# Altium schematic sheet FIT_HDMI_X21-17.SchDoc: FIT_PM12 board
size 420 x 297 mm; CheckedBy: G.Kasprowicz; Author: INR Moscow; CompanyName: WUT ISE; DrawnBy: M.Podgórski; Organization: WUT ISE; Address1: PW ISE; Address2: Nowowiejska 15/19 00-665 Warsaw; Address3: gkasprow@gmail.com; Revision: 2; SheetNumber: -; SheetTotal: -; ModifiedBy: -; CheckedDate: -; Title2: Title 2; DivGrp: WUT ISE; Designer: INR RAS; ModifiedDate: -; ProjectName: Sensor Box
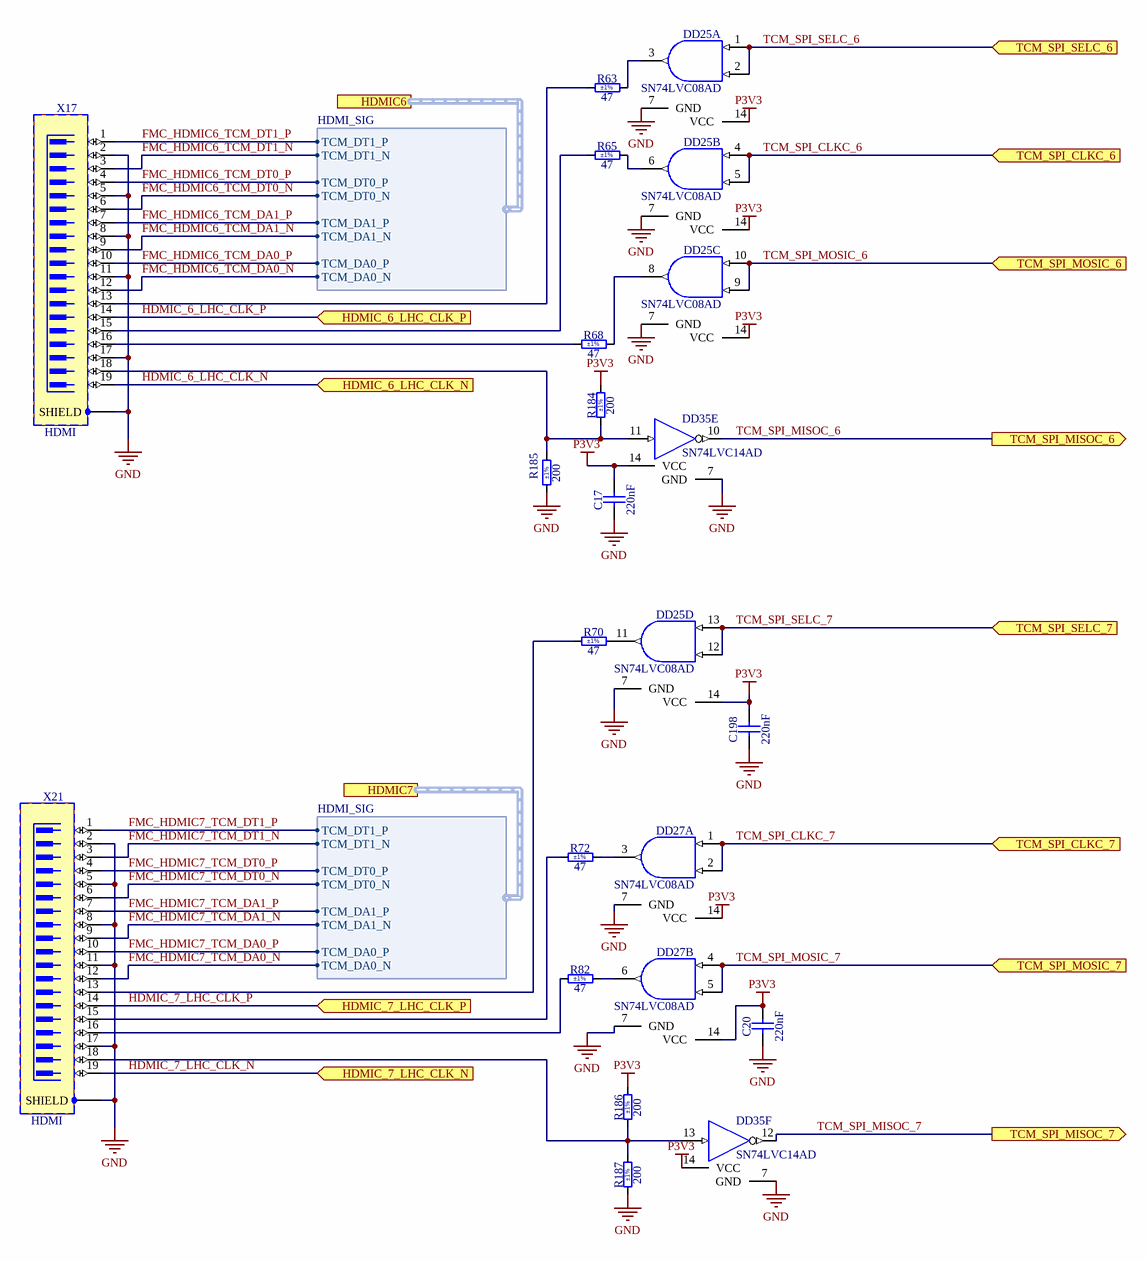
[diagram p0: FIT_HDMI_X21-17.SchDoc]

## Parts
C17  220nF  [CAPC2012X135N]
C20  220nF  [CAPC2012X135N]
C198  220nF  [CAPC2012X135N]
DD25  SN74LVC08AD  [SOIC127P600X175-14N]  (parts A,B,C,D of 4)
DD27  SN74LVC08AD  [SOIC127P600X175-14N]  (parts A,B of 4)
DD35  SN74LVC14AD  [SOIC127P600X175-14N]  (parts E,F of 6)
R63  47  Tolerance: ±1%  [RESC2012X60N]
R65  47  Tolerance: ±1%  [RESC2012X60N]
R68  47  Tolerance: ±1%  [RESC2012X60N]
R70  47  Tolerance: ±1%  [RESC2012X60N]
R72  47  Tolerance: ±1%  [RESC2012X60N]
R82  47  Tolerance: ±1%  [RESC2012X60N]
R184  200  Tolerance: ±1%  [RESC2012X60N]
R185  200  Tolerance: ±1%  [RESC2012X60N]
R186  200  Tolerance: ±1%  [RESC2012X60N]
R187  200  Tolerance: ±1%  [RESC2012X60N]
X17  HDMI  [TYCO_2007435-1]
X21  HDMI  [TYCO_2007435-1]

## Ports
HDMIC6 (harness HDMI_SIG), HDMIC7 (harness HDMI_SIG), HDMIC_6_LHC_CLK_N (in), HDMIC_6_LHC_CLK_P (in), HDMIC_7_LHC_CLK_N (in), HDMIC_7_LHC_CLK_P (in), TCM_SPI_CLKC_6 (in), TCM_SPI_CLKC_7 (in), TCM_SPI_MISOC_6 (out), TCM_SPI_MISOC_7 (out), TCM_SPI_MOSIC_6 (in), TCM_SPI_MOSIC_7 (in), TCM_SPI_SELC_6 (in), TCM_SPI_SELC_7 (in)

## Harnesses
HDMI_SIG: TCM_DT1_P, TCM_DT1_N, TCM_DT0_P, TCM_DT0_N, TCM_DA1_P, TCM_DA1_N, TCM_DA0_P, TCM_DA0_N

## Nets
GND: C17.1 C20.1 C198.1 DD25.7(GND) DD27.7(GND) DD35.7(GND) R185.1 R187.1 X17.2 X17.5 X17.8 X17.11 X17.17 X17.SHIELD X21.2 X21.5 X21.8 X21.11 X21.17 X21.SHIELD
P3V3: C17.2 C20.2 C198.2 DD25.14(VCC) DD27.14(VCC) DD35.14(VCC) R184.2 R186.2  [also labelled VCC]
FMC_HDMIC6_TCM_DA0_N: X17.12 ; port HDMIC6.TCM_DA0_N
FMC_HDMIC6_TCM_DA0_P: X17.10 ; port HDMIC6.TCM_DA0_P
FMC_HDMIC6_TCM_DA1_N: X17.9 ; port HDMIC6.TCM_DA1_N
FMC_HDMIC6_TCM_DA1_P: X17.7 ; port HDMIC6.TCM_DA1_P
FMC_HDMIC6_TCM_DT0_N: X17.6 ; port HDMIC6.TCM_DT0_N
FMC_HDMIC6_TCM_DT0_P: X17.4 ; port HDMIC6.TCM_DT0_P
FMC_HDMIC6_TCM_DT1_N: X17.3 ; port HDMIC6.TCM_DT1_N
FMC_HDMIC6_TCM_DT1_P: X17.1 ; port HDMIC6.TCM_DT1_P
FMC_HDMIC7_TCM_DA0_N: X21.12 ; port HDMIC7.TCM_DA0_N
FMC_HDMIC7_TCM_DA0_P: X21.10 ; port HDMIC7.TCM_DA0_P
FMC_HDMIC7_TCM_DA1_N: X21.9 ; port HDMIC7.TCM_DA1_N
FMC_HDMIC7_TCM_DA1_P: X21.7 ; port HDMIC7.TCM_DA1_P
FMC_HDMIC7_TCM_DT0_N: X21.6 ; port HDMIC7.TCM_DT0_N
FMC_HDMIC7_TCM_DT0_P: X21.4 ; port HDMIC7.TCM_DT0_P
FMC_HDMIC7_TCM_DT1_N: X21.3 ; port HDMIC7.TCM_DT1_N
FMC_HDMIC7_TCM_DT1_P: X21.1 ; port HDMIC7.TCM_DT1_P
HDMIC_6_LHC_CLK_N: X17.19 ; port HDMIC_6_LHC_CLK_N
HDMIC_6_LHC_CLK_P: X17.14 ; port HDMIC_6_LHC_CLK_P
HDMIC_7_LHC_CLK_N: X21.19 ; port HDMIC_7_LHC_CLK_N
HDMIC_7_LHC_CLK_P: X21.14 ; port HDMIC_7_LHC_CLK_P
TCM_SPI_CLKC_6: DD25.4(A) DD25.5(B) ; port TCM_SPI_CLKC_6
TCM_SPI_CLKC_7: DD27.1(A) DD27.2(B) ; port TCM_SPI_CLKC_7
TCM_SPI_MISOC_6: DD35.10(OUT) ; port TCM_SPI_MISOC_6
TCM_SPI_MISOC_7: DD35.12(OUT) ; port TCM_SPI_MISOC_7
TCM_SPI_MOSIC_6: DD25.9(B) DD25.10(A) ; port TCM_SPI_MOSIC_6
TCM_SPI_MOSIC_7: DD27.4(A) DD27.5(B) ; port TCM_SPI_MOSIC_7
TCM_SPI_SELC_6: DD25.1(A) DD25.2(B) ; port TCM_SPI_SELC_6
TCM_SPI_SELC_7: DD25.12(B) DD25.13(A) ; port TCM_SPI_SELC_7
NetDD25_3: DD25.3(Y) R63.2
NetDD25_6: DD25.6(Y) R65.2
NetDD25_8: DD25.8(Y) R68.2
NetDD25_11: DD25.11(Y) R70.2
NetDD27_3: DD27.3(Y) R72.2
NetDD27_6: DD27.6(Y) R82.2
NetDD35_11: DD35.11(IN) R184.1 R185.2 X17.18
NetDD35_13: DD35.13(IN) R186.1 R187.2 X21.18
NetR63_1: R63.1 X17.13
NetR65_1: R65.1 X17.15
NetR68_1: R68.1 X17.16
NetR70_1: R70.1 X21.13
NetR72_1: R72.1 X21.15
NetR82_1: R82.1 X21.16

## Notes on the sheet
- Project/Equipment
- Document
- Designer
- Drawn by
- Check.by
- Copyright WUT ISE 2024.
  This documentation describes Open Hardware and is licensed under the CERN OHL v.2. You may redistribute and modify this documentation under the terms of the CERN OHL v.2. (http://ohwr.org/CERNOHL). This documentation is distributed WITHOUT ANY EXPRESS OR IMPLIED WARRANTY, INCLUDING OF MERCHANTABILITY, SATISFACTORY QUALITY AND FITNESS FOR A PARTICULAR PURPOSE. Please see the CERN OHL v.2 for applicable conditions.
- Contact
- File
- Last Mod.
- Print Date
- Sheet
- Size
- A3
- of
- Rev

## Library data of the parts
C17 C20 C198 = CC0805_220NF_50V_10%_X7R: Non-polarised capacitor; Part Description: SMD Multilayer Chip Ceramic Capacitor; Manufacturer: GENERIC; Manufacturer1 Part Number: GRM21BR71H224KA01L; Voltage: 50V; TC: X7R; Tolerance: ±10%; Part Number: CC0805_220NF_50V_10%_X7R; Component Kind: Standard; Component Type: Standard; Pin Count: 2; Value: 220nF; Status: Preferred; Manufacturer Part Number: CC0805_220NF_50V_10%_X7R; Case: 0805; Mounted: Yes; Socket: No; SMD: Yes; Sense: No; Manufacturer1 Example: MURATA; Manufacturer1 ComponentHeight: 1.35mm; HelpURL: \\cern.ch\dfs\Applications\Altium\Datasheets\CC0805_X7R_MURATA.pdf; Author: CERN DEM JLC; CreateDate: 03.12.2007; LatestRevisionDate: 03.12.2007
DD25 DD27 = SN74LVC08AD: Quad 2-Input AND Gate; Part Description: Quadruple 2-Input Positive-AND Gate; Manufacturer: TEXAS INSTRUMENTS; PressFit: No; Bonding: No; Part Number: SN74LVC08AD; Component Kind: Standard; Component Type: Standard; Device: SN74LVC08AD; PackageDescription: SOIC 14, Pitch 1.27mm - Body 4x8.75mm, IPC Medium Density; Manufacturer Part Number: SN74LVC08AD; Pin Count: 14; Case: SOIC14; Mounted: Yes; Socket: No; SMD: Yes; Sense: No; ComponentHeight: 1.75mm; Author: CERN DEM JLC; HelpURL: \\cern.ch\dfs\Applications\Altium\Datasheets\SN74LVC08AD.pdf; CreateDate: 21.03.2012; LatestRevisionDate: 21.03.2012
DD35 = SN74LVC14AD: Hex Schmitt-Trigger Inverter; Manufacturer: TEXAS INSTRUMENTS; PressFit: No; Bonding: No; Part Number: SN74LVC14AD; Component Kind: Standard; Component Type: Standard; Device: SN74LVC14AD; PackageDescription: SOIC 14, Pitch 1.27mm - Body 4x8.75mm, IPC Medium Density; Part Description: Hex Schmitt-Trigger Inverter; Manufacturer Part Number: SN74LVC14AD; Pin Count: 14; Case: SOIC14; Mounted: Yes; Socket: No; SMD: Yes; Sense: No; ComponentHeight: 1.75mm; Author: CERN DEM JMW; HelpURL: \\cern.ch\dfs\Applications\Altium\Datasheets\SN74LVC14AD.pdf; CreateDate: 29.09.2008; LatestRevisionDate: 29.09.2008
R63 R65 R68 R70 R72 R82 = R0805_47R_1%_0.125W_100PPM: Resistor - 1%; Part Description: General Purpose Thick Film Chip Resistor; Manufacturer: GENERIC; Manufacturer1 Part Number: NRC10F47R0TRF; Power: 0.125W; TC: ±100ppm/°C; PressFit: No; Part Number: R0805_47R_1%_0.125W_100PPM; Component Kind: Standard; Component Type: Standard; Pin Count: 2; Value: 47; Status: Preferred; Manufacturer Part Number: R0805_47R_1%_0.125W_100PPM; Case: 0805; Mounted: Yes; Sense: No; Socket: No; SMD: Yes; Manufacturer1 Example: NIC COMPONENT; Manufacturer1 ComponentHeight: 0.6mm; HelpURL: \\cern.ch\dfs\Applications\Altium\Datasheets\R0805_NIC_NRC.pdf; Author: CERN DEM JLC; CreateDate: 03.12.2007; LatestRevisionDate: 13.03.2008
R184-R187 = R0805_200R_1%_0.125W_100PPM: Resistor - 1%; Part Description: General Purpose Thick Film Chip Resistor; Manufacturer: GENERIC; Manufacturer1 Part Number: NRC10F2000TRF; Power: 0.125W; TC: ±100ppm/°C; PressFit: No; Part Number: R0805_200R_1%_0.125W_100PPM; Component Kind: Standard; Component Type: Standard; Pin Count: 2; Value: 200; Status: Preferred; Manufacturer Part Number: R0805_200R_1%_0.125W_100PPM; Case: 0805; Mounted: Yes; Sense: No; Socket: No; SMD: Yes; Manufacturer1 Example: NIC COMPONENT; Manufacturer1 ComponentHeight: 0.6mm; HelpURL: \\cern.ch\dfs\Applications\Altium\Datasheets\R0805_NIC_NRC.pdf; Author: CERN DEM JLC; CreateDate: 03.12.2007; LatestRevisionDate: 13.03.2008
X17 X21 = TYCO_2007435-1: Connector HDMI 19 Male + 1 Shield; Part Description: 0.578mm Pitch, Through-Hole Right Angle 19 Contacts Flag-HDMI Type-A Receptacle Thru Hole Mounting Pads; Manufacturer: TYCO ELECTRONICS; PressFit: No; Part Number: TYCO_2007435-1; Component Kind: Standard; Component Type: Standard; Pin Count: 23; Family: HDMI; Mounted: Yes; Socket: No; SMD: No; Sense: No; Status: None; Manufacturer Part Number: 2007435-1; ComponentHeight: 16.4mm; HelpURL: \\cern.ch\dfs\Applications\Altium\Datasheets\TYCO_2007435-1.pdf; Author: CERN DEM MR; CreateDate: 05.07.2016; LatestRevisionDate: 05.07.2016